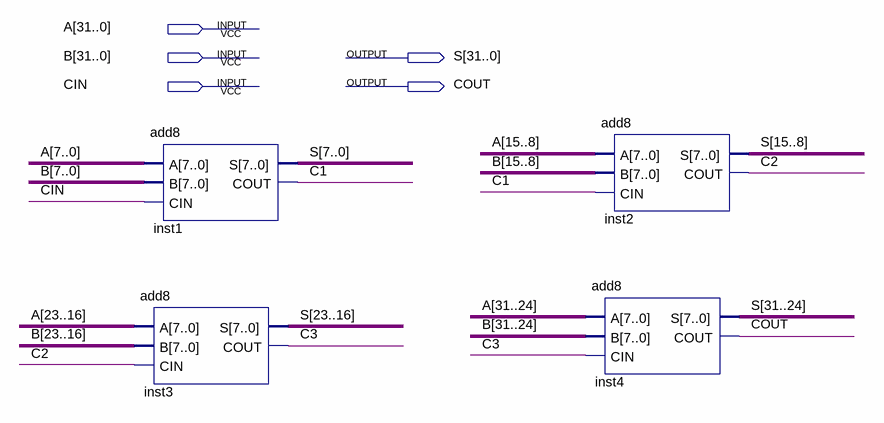
[diagram p0: schematic sheet]
// Quartus schematic add32.bdf as structural Verilog: 4 symbols, 5 pins
module add32 (
  input  [31:0] A,
  input  [31:0] B,
  input  CIN,
  output [31:0] S,
  output COUT
);

  wire C1, C2, C3;

  add8 inst1 (.A(A[7:0]), .B(B[7:0]), .CIN(CIN), .S(S[7:0]), .COUT(C1));
  add8 inst3 (.A(A[23:16]), .B(B[23:16]), .CIN(C2), .S(S[23:16]), .COUT(C3));
  add8 inst2 (.A(A[15:8]), .B(B[15:8]), .CIN(C1), .S(S[15:8]), .COUT(C2));
  add8 inst4 (.A(A[31:24]), .B(B[31:24]), .CIN(C3), .S(S[31:24]), .COUT(COUT));
endmodule
